# EAGLE schematic DIN (EAGLE 7.1.0)
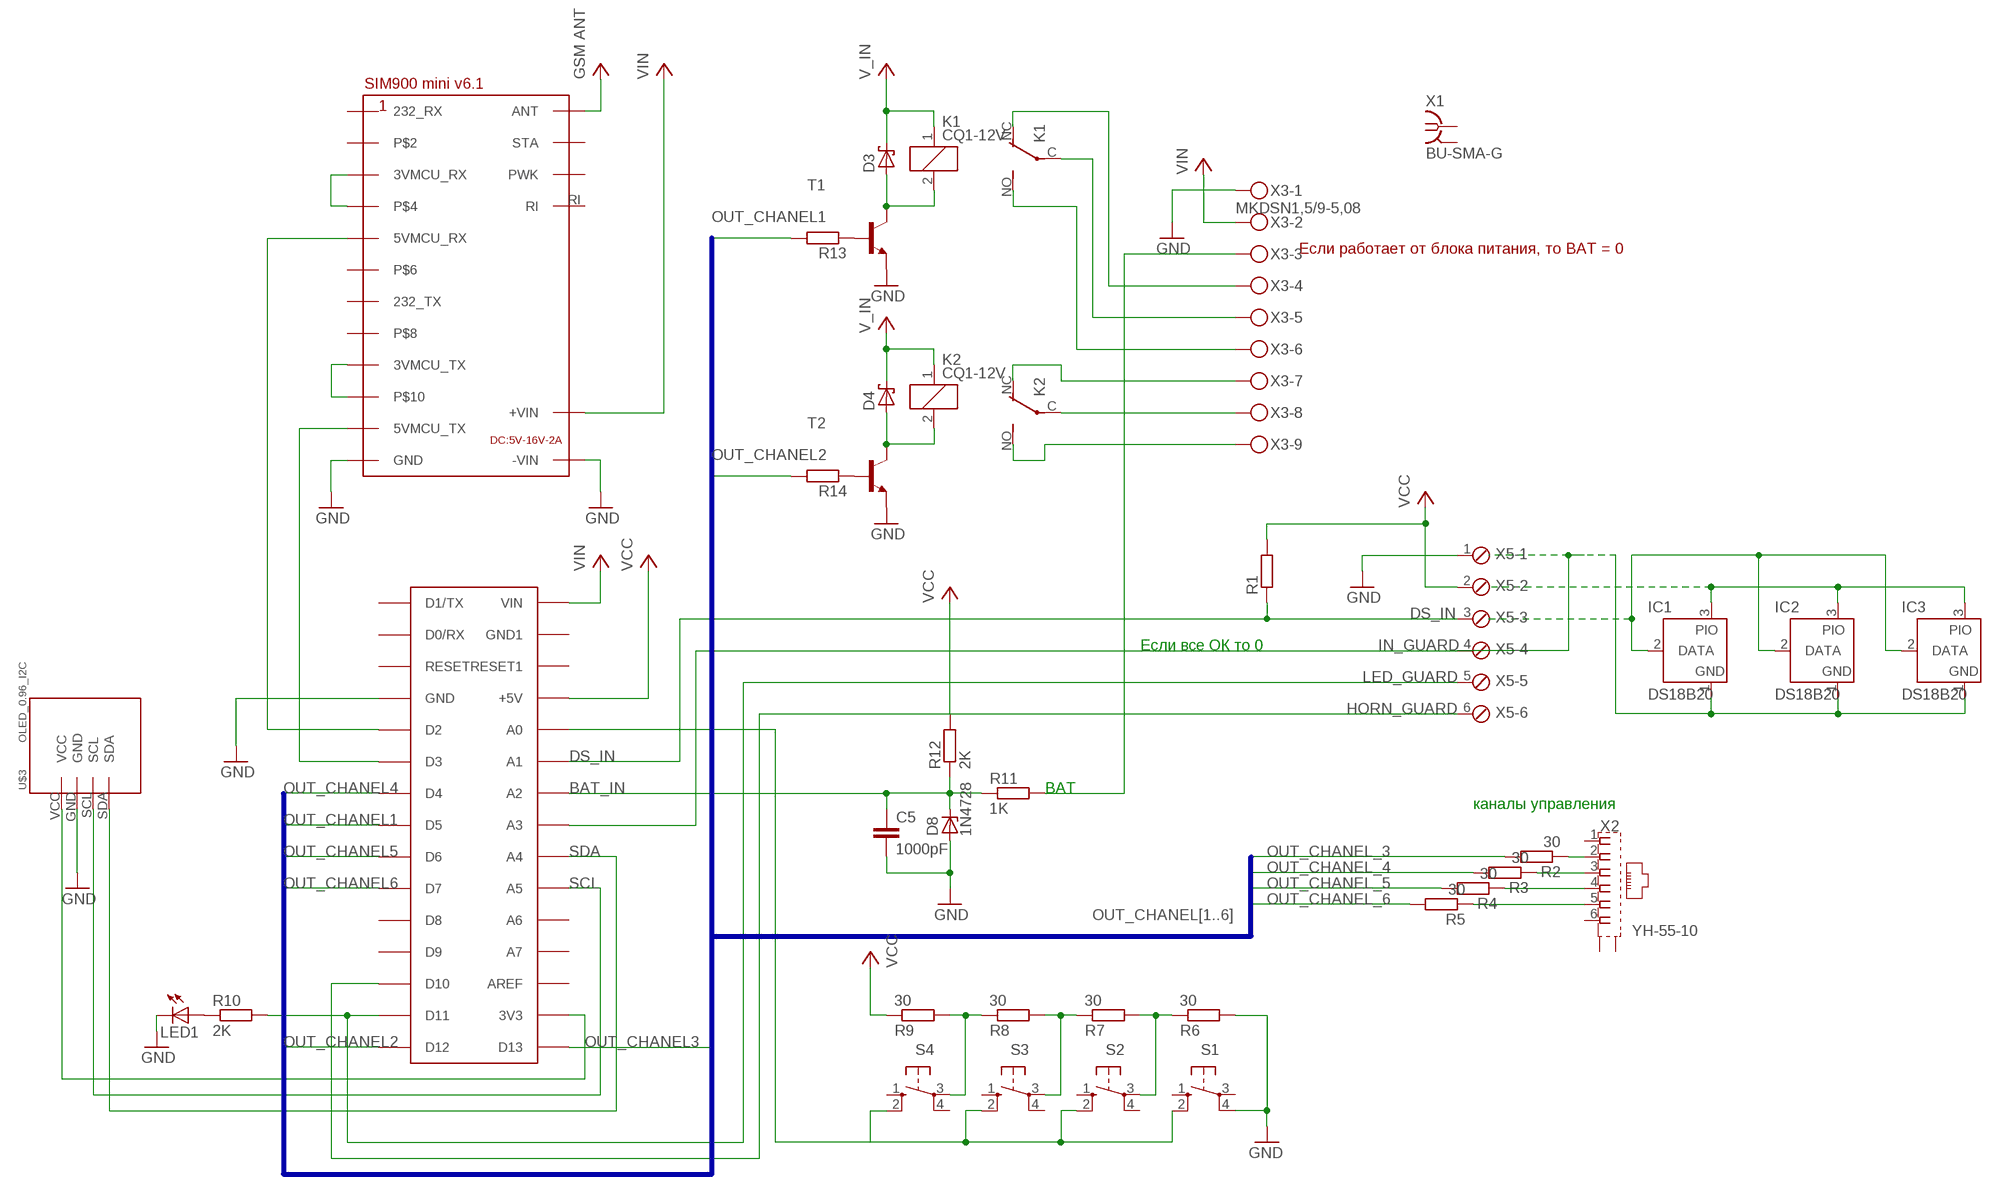
[diagram p0: schematic, sheet 1]

## Parts
1  SIM900  [SIM900]
C5  1000pF  C5/2.5  [C5B2.5]
D3  SCHOTTKY-DIODEDO35-7  [DO35-7]
D4  SCHOTTKY-DIODEDO35-7  [DO35-7]
D8  1N4728  [DO41Z10]
IC1  DS18B20  DS2405  [TO92-]
IC2  DS18B20  DS2405  [TO92-]
IC3  DS18B20  DS2405  [TO92-]
K1  CQ1-12V  [CQ1]
K2  CQ1-12V  [CQ1]
LED1  LED3MM  [LED3MM]
R1  R-EU_0204/7  [0204/7]
R2  30  R-EU_0204/7  [0204/7]
R3  30  R-EU_0204/7  [0204/7]
R4  30  R-EU_0204/7  [0204/7]
R5  30  R-EU_0204/7  [0204/7]
R6  30  R-EU_0204/7  [0204/7]
R7  30  R-EU_0204/7  [0204/7]
R8  30  R-EU_0204/7  [0204/7]
R9  30  R-EU_0204/7  [0204/7]
R10  2K  R-EU_0204/7  [0204/7]
R11  1K  R-EU_0204/7  [0204/7]
R12  2K  R-EU_0204/7  [0204/7]
R13  R-EU_0204/7  [0204/7]
R14  R-EU_0204/7  [0204/7]
S1  10-XX  [B3F-10XX]
S2  10-XX  [B3F-10XX]
S3  10-XX  [B3F-10XX]
S4  10-XX  [B3F-10XX]
T1  -NPN-TO92  [TO92]
T2  -NPN-TO92  [TO92]
U$1  ARDUINONANO  [PDIP-32]
U$3  OLED_0.96_I2C  [OLED_0.96_I2C]
X1  BU-SMA-G  [BU-SMA-G]
X2  YH-55-10  [YH-55-10]
X3  MKDSN1,5/9-5,08  [MKDSN1,5/9-5,08]
X5  MPT6  [6POL254]

## Nets
BAT_IN: C5.1 D8.C R11.1 R12.1 U$1.A2
DS_IN: R1.1 U$1.A1 X5.3
GND: 1.-VIN 1.GND C5.2 D8.A LED1.K(C) R6.2 S1.4(P1) T1.1(E) T2.1(E) U$1.GND U$3.GND X3.1 X5.1
HORN_GUARD: U$1.D10 X5.6
IN_GUARD: IC1.1(GND) IC2.1(GND) IC3.1(GND) U$1.A3 X5.4
LED_GUARD: R10.2 U$1.D11 X5.5
N$1: R11.2 X3.3
N$2: R2.1 X2.2
N$3: R3.1 X2.3
N$4: R4.1 X2.4
N$5: U$1.3V3 U$3.VCC
N$6: IC1.2(DATA) IC2.2(DATA) IC3.2(DATA)
N$7: 1.5VMCU_TX U$1.D3
N$8: 1.5VMCU_RX U$1.D2
N$9: 1.3VMCU_RX 1.P$4
N$10: 1.3VMCU_TX 1.P$10
N$11: D3.A K1.2 T1.3(C)
N$12: R13.1 T1.2(B)
N$13: R14.1 T2.2(B)
N$14: D4.A K2.2 T2.3(C)
N$15: K1.NC(2:O) X3.4
N$16: K1.C(2:P) X3.5
N$17: K1.NO(2:S) X3.6
N$18: K2.NC(2:O) X3.7
N$19: K2.C(2:P) X3.8
N$20: K2.NO(2:S) X3.9
N$22: R5.1 X2.5
N$23: LED1.A R10.1
N$26: IC1.3(PIO) IC2.3(PIO) IC3.3(PIO)
N$30: R6.1 R7.2 S2.3(P)
N$32: R7.1 R8.2 S3.3(P)
N$33: R8.1 R9.2 S4.3(P)
N$35: S1.2(S1) S2.2(S1) S3.2(S1) S4.2(S1) U$1.A0
OUT_CHANEL1: R13.2 U$1.D5
OUT_CHANEL2: R14.2 U$1.D12
OUT_CHANEL3: U$1.D13
OUT_CHANEL4: U$1.D4
OUT_CHANEL5: U$1.D6
OUT_CHANEL6: U$1.D7
OUT_CHANEL_3: R2.2
OUT_CHANEL_4: R3.2
OUT_CHANEL_5: R4.2
OUT_CHANEL_6: R5.2
SCL: U$1.A5 U$3.SCL
SDA: U$1.A4 U$3.SDA
VCC: 1.+VIN 1.ANT D3.C D4.C K1.1 K2.1 R1.2 R9.1 R12.2 U$1.+5V U$1.VIN X3.2 X5.2 ; supply symbol labelled VIN, V_IN, GSM ANT
Unconnected: 1.232_RX 1.232_TX 1.P$2 1.P$6 1.P$8 1.PWK 1.RI 1.STA S1.1(S) S1.3(P) S2.1(S) S2.4(P1) S3.1(S) S3.4(P1) S4.1(S) S4.4(P1) U$1.A6 U$1.A7 U$1.AREF U$1.D0/RX U$1.D1/TX U$1.D8 U$1.D9 U$1.GND1 U$1.RESET U$1.RESET1 X1.1 X1.2 X1.3 X1.4 X1.5 X2.1 X2.6 X2.S1(S) X2.S2(S)

## Buses
OUT_CHANEL[1..6]

## Notes on the sheet
- Если работает от блока питания, то ВАТ = 0
- Если все ОК то 0
- BAT
- каналы управления

## Library data of the parts
1 = my:SIM900: SIM900 mini board V6.1
C5 = capacitor-wima:C: CAPACITOR naming: grid - package width
D3 D4 = adafruit:SCHOTTKY-DIODE: Schottky Diode
D8 = diode:1N4728: Z DIODE 3.3 V, 1W, 5 percent
IC1-IC3 = maxim:DS2405: Addressable Switch DALLAS Semiconductor; MF: DALLAS SEMICONDUCTOR; MPN: DS2405; OC_FARNELL: 1188025; OC_NEWARK: 06F4645
K1 K2 = relay:CQ1-12V: AUTOMOTIVE QUIET RELAY NAiS Source: http://www.mew-europe.com/.. en_ds_61208_0000.pdf; OC_FARNELL: unknown; OC_NEWARK: unknown
LED1 = adafruit:LED: LED OSRAM: - CHIPLED LG R971, LG N971, LY N971, LG Q971, LY Q971, LO R971, LY R971 LH N974, LH R974 LS Q976, LO Q976, LY Q976 LO Q996 - Hyper CHIPLED LW Q18S LB Q993, LB Q99A, LB R99A - SideLED LS A670, LO A670, LY A670, LG A670, LP A670 LB A673, LV A673, LT A673, LW A673 LH A674 LY A675 LS A676, LA A676, LO A676, LY A676, LW A676 LS A679, LY A679, LG A679 - Hyper Micro SIDELED® LS Y876, LA Y876, LO Y876, LY Y876 LT Y87S - SmartLED LW L88C, LW L88S LB L89C, LB L89S, LG L890 LS L89K, LO L89K, LY L89K LS L896, LA L896, LO L896, LY L896 - TOPLED LS T670, LO T670, LY T670, LG T670, LP T670 LSG T670, LSP T670, LSY T670, LOP T670, LYG T670 LG T671, LOG T671, LSG T671 LB T673, LV T673, LT T673, LW T673 LH T674 LS T676, LA T676, LO T676, LY T676, LB T676, LH T676, LSB T676, LW T676 LB T67C, LV T67C, LT T67C, LS T67K, LO T67K, LY T67K, LW E67C LS E67B, LA E67B, LO E67B, LY E67B, LB E67C, LV E67C, LT E67C LW T67C LS T679, LY T679, LG T679 LS T770, LO T770, LY T770, LG T770, LP T770 LB T773, LV T773, LT T773, LW T773 LH T774 LS E675, LA E675, LY E675, LS T675 LS T776, LA T776, LO T776, LY T776, LB T776 LHGB T686 LT T68C, LB T68C - Hyper Mini TOPLED® LB M676 - Mini TOPLED Santana® LG M470 LS M47K, LO M47K, LY M47K Source: http://www.osram.convergy.de/
R1-R14 = rcl:R-EU_: RESISTOR, European symbol
S1-S4 = switch-omron:10-XX: OMRON SWITCH; MPN: B3F-1000; OC_FARNELL: 176432; OC_NEWARK: 36M3542
T1 T2 = transistor:*-NPN-: NPN Transistror BF959 corrected 2008.03.06
U$1 = jet-lib:ARDUINONANO; A1: DS18B20; A2: BAT; A3: GUARD
U$3 = tft_1.8_1.44_oled_0.96:OLED_0.96_I2C
X1 = con-coax:BU-SMA-G: FEMALE SMA CONNECTOR Radiall distributor RS 193-9117; OC_FARNELL: unknown; OC_NEWARK: unknown
X2 = con-wenzhou-yihua:YH-55-10: RJ11 6 connects Source: YH-55-10.pdf; OC_FARNELL: unknown; OC_NEWARK: unknown
X3 = con-phoenix-508:MKDSN1,5/9-5,08: MKDSN 1,5/ 9-5,08 Printklemme Nennstrom: 13,5 A Nennspannung: 250 V Rastermaß: 5,08 mm Polzahl: 9 Anschlussart: Schraubanschluss Montage: Löten Anschlussrichtung Leiter/Platine: 0 ° Artikelnummer: 1729199 Source: http://eshop.phoenixcontact.com .. 1729199.pdf
X5 = con-phoenix-254:MPT6: PHOENIX CONNECTOR; OC_FARNELL: unknown; OC_NEWARK: unknown